# EAGLE design main (EAGLE 9.5.0)
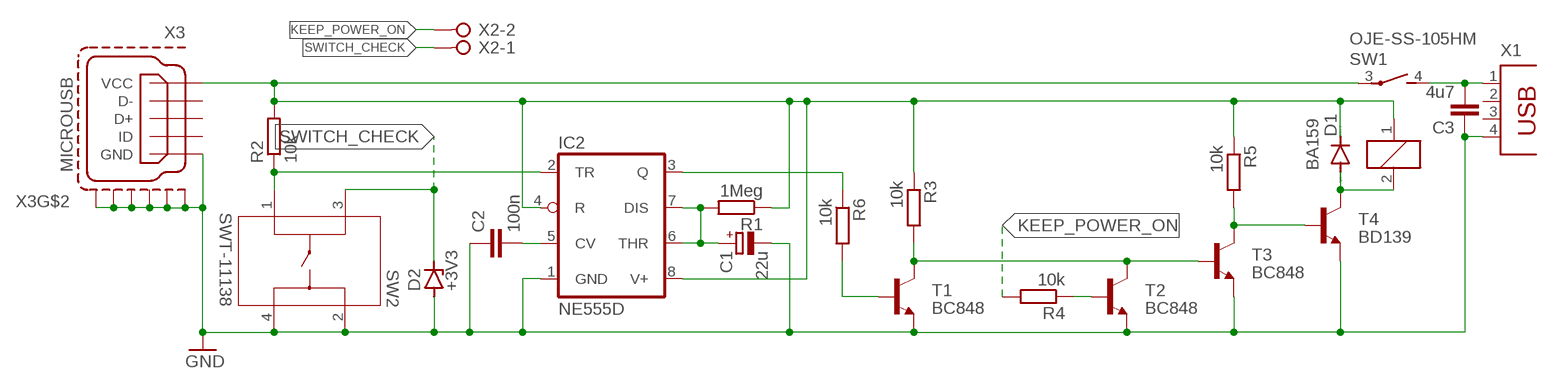
[diagram p0: schematic, sheet 1]

## Parts
C1  22u  CPOL-EUSMCB  [SMC_B]
C2  100n  C-EUC0805  [C0805]
C3  4u7  C-EU050-075X075  [C050-075X075]
D1  BA159  1N4004  [DO41-10]
D2  +3V3  ZENER-DIODESOD80C  [SOD80C]
IC2  NE555D  [SO08]
R1  1Meg  R-EU_R1206  [R1206]
R2  10k  R-EU_R1206  [R1206]
R3  10k  R-EU_R1206  [R1206]
R4  10k  R-EU_R1206  [R1206]
R5  10k  R-EU_R1206  [R1206]
R6  10k  R-EU_R1206  [R1206]
SW1  OJE-SS-105HM  [OJE-SS-105HM]
SW2  SWT-11138  [SWT-11138]
T1  BC848  [SOT23]
T2  BC848  [SOT23]
T3  BC848  [SOT23]
T4  BD139  [TO126]
X1  PN87520  [PN87520]
X2  W237-02P  [W237-132]
X3  MICROUSB  [MICROUSB]

## Nets
+5V [power]: D1.C IC2.4(R) IC2.8(V+) R1.1 R2.2 R3.1 R5.1 SW1.1 SW1.3(S:P) X3.1(VCC)
GND: C1.- C2.1 C3.1 D2.A IC2.1(GND) SW2.2 SW2.4 T1.2(E) T2.2(E) T3.2(E) T4.1(E) X1.4 X3.5(GND) X3.P$1(S1) X3.P$2(S2) X3.P$3(S3) X3.P$4(S4) X3.P$5(S5) X3.P$6(S6)
KEEP_POWER_ON: R4.2 X2.2
N$1: C1.+ IC2.6(THR) IC2.7(DIS) R1.2
N$2: R6.2 T1.1(B)
N$3: C2.2 IC2.5(CV)
N$4: IC2.2(TR) R2.1 SW2.1
N$5: IC2.3(Q) R6.1
N$12: R5.2 T3.3(C) T4.3(B)
N$15 [power]: C3.2 SW1.4(S:S) X1.1
N$19: R4.1 T2.1(B)
N$20: R3.2 T1.3(C) T2.3(C) T3.1(B)
N$21 [power]: D1.A SW1.2 T4.2(C)
SWITCH_CHECK: D2.C SW2.3 X2.1
Unconnected: X1.2 X1.3 X3.2(D-) X3.3(D+) X3.4(ID)

## Library data of the parts
C1 = rcl:CPOL-EU: POLARIZED CAPACITOR, European symbol; SPICEPREFIX: C
C2 C3 = rcl:C-EU: CAPACITOR, European symbol; SPICEPREFIX: C
D1 = diode:1N4004: DIODE general purpose rectifier, 1 A
D2 = diode:ZENER-DIODE: Z-Diode
IC2 = linear:*555: TIMER
R1-R6 = rcl:R-EU_: RESISTOR, European symbol; SPICEPREFIX: R
SW1 = Marcin-relay:OJE-SS-105HM: Miniature PCB Relay OJ/OJE
SW2 = Marcin-con:SWT-11138
T1-T3 = transistor:BC848: NPN TRANSISTOR
T4 = transistor:BD139: NPN TRANSISTOR
X1 = con-berg:PN87520: BERG USB connector; OC_FARNELL: unknown; OC_NEWARK: unknown
X2 = con-wago-508:W237-02P: WAGO SREW CLAMP; OC_FARNELL: unknown; OC_NEWARK: unknown
X3 = Marcin-con:MICROUSB: AMPHENOL 10118192-0001LF Micro USB type B Do zamówienia z TME <https://www.tme.eu/pl/details/10118192-0001lf_c/zlacza-usb-i-ieee1394/amphenol/10118192-0001lf/>

## Net classes
1 power: clearance 1.27 mm

## Board
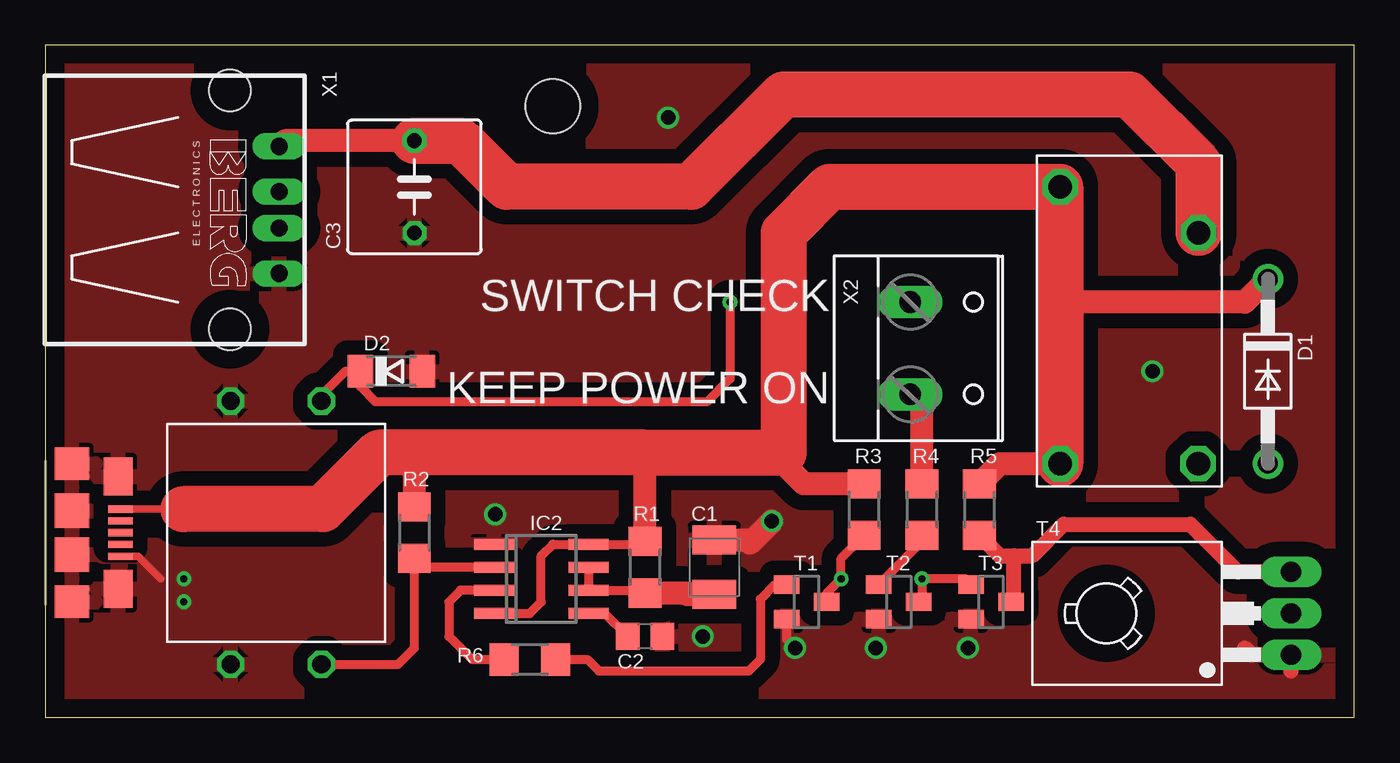
[diagram p1: board, top side]
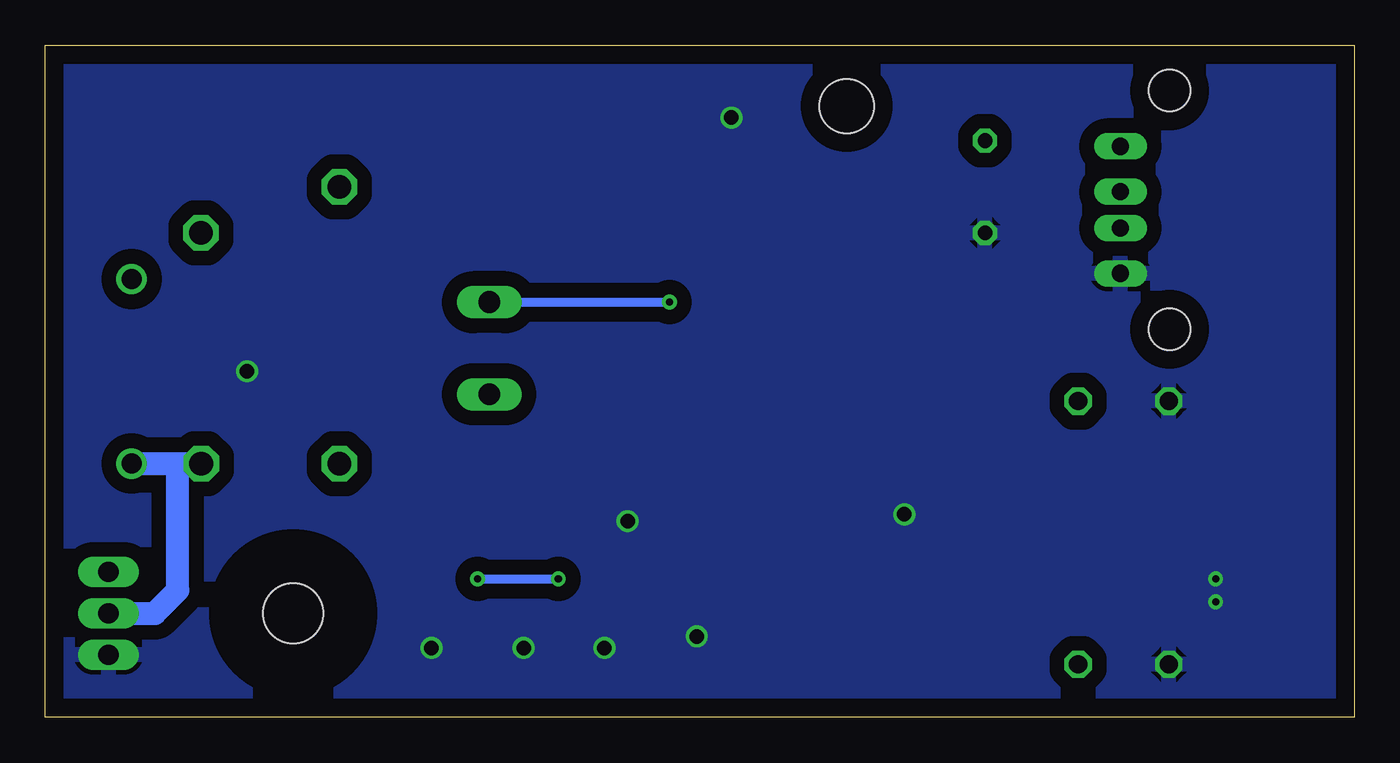
[diagram p2: board, bottom side, seen from below]

Size 72.06 x 37 mm. Coordinates in mm from the lower left corner, seen from the top.
Outline: 0,0 72.06,0 72.06,37 0,37 0,0
Copper layers (1*16): Top 0.035mm / dielectric 1.5mm / Bottom 0.035mm
Design rules "default *": minimum track width 6mil, minimum drill 0.35mm, track to track 6mil, track to pad 6mil, pad to pad 6mil, via to via 6mil, smd to smd 6mil, copper to edge 40mil, drill to drill 6mil, minimum pad ring 10mil, minimum via ring 8mil, stop-mask expansion 4mil, vias tented up to drill 0.4mm, thermal gap 10mil
Holes 3 mm at 27.94,33.65

### Footprints (pad centres in the part's own frame; a part is rotated, then mirrored left to right if it is on the bottom)
SMC_B = smd 1.6 x 2.4: + -1.5,0; - 1.5,0
C0805 = smd 1.3 x 1.5: 1 -0.95,0; 2 0.95,0
C050-075X075 = drill 0.813 octagon: 1 -2.54,0; 2 2.54,0
DO41-10 = drill 1.118: A 5.08,0; C -5.08,0
SOD80C = smd 1.4 x 1.8: A 1.7,0; C -1.7,0
SO08 = smd 0.6 x 2.2: 1 -1.905,-2.6; 2 -0.635,-2.6; 3 0.635,-2.6; 4 1.905,-2.6; 5 1.905,2.6; 6 0.635,2.6; 7 -0.635,2.6; 8 -1.905,2.6
R1206 = smd 1.6 x 1.803: 1 -1.422,0; 2 1.422,0
OJE-SS-105HM = drill 1.3 octagon: 1 0,0; 2 0,-7.6; 3 15.24,0; 4 12.7,-7.62
SWT-11138 = drill 1 octagon: 1 -2.5,7.25; 2 2.5,7.25; 3 -2.5,-7.25; 4 2.5,-7.25
SOT23 = smd 1 x 1.4: 1 -0.95,-1.1; 2 0.95,-1.1; 3 0,1.1
TO126 = drill 1.118 long: 1 -2.286,-5.08; 2 0,-5.08; 3 2.286,-5.08 | hole 3.302: 0,5.08
PN87520 = drill 0.95 long: 1 -3.5,2.71; 2 -1,2.71; 3 1,2.71; 4 3.5,2.71 | hole 2.3: -6.57,0; 6.57,0
W237-132 = drill 1.194 long: 1 -2.54,-0.635; 2 2.54,-0.635
MICROUSB = smd 0.4 x 1.35: 1 -1.3,4.125; 2 -0.65,4.125; 3 0,4.125; 4 0.65,4.125; 5 1.3,4.125 | smd 2.1 x 1.6: P$1 -3.1,4; P$2 3.1,4 | smd 1.8 x 1.9: P$3 3.8,1.45; P$4 -3.8,1.45 | smd 1.9 x 1.9: P$5 1.2,1.45; P$6 -1.2,1.45

### Placement (x,y rotation side)
C1  36.83,8.26 90 top
C2  33.02,4.45 180 top
C3  20.32,29.21 90 top
D1  67.31,19.05 270 top
D2  19.05,19.05 0 top
IC2  27.3,7.62 270 top
R1  33.02,8.26 270 top
R2  20.32,10.16 90 top
R3  45.08,11.43 270 top
R4  48.26,11.43 90 top
R5  51.43,11.43 270 top
R6  26.67,3.18 0 top
SW1  55.88,13.97 90 top
SW2  12.7,10.16 180 top
T1  41.91,6.35 270 top
T2  46.99,6.35 270 top
T3  52.07,6.35 270 top
T4  63.5,5.71 90 top
X1  10.16,27.94 270 top
X2  48.26,20.32 270 top
X3  0,10.16 270 top

### Tracks (layer width: path | path; a pad name or v marks a point on that pad's centre or on a via)
+5V
  Top 0.406: X3.1 7.59,11.46
  Top 0.508: R1.1 32.87,9.53 IC2.8 27.94,9.53 27.3,8.89 27.3,6.35 26.67,5.71 IC2.4
  Top 1.27: R5.1 52.55,13.97 SW1.1 | D1.C 66.04,22.86 55.88,22.86 | R3.1 41.76,12.85 40.64,13.97 40.64,14.57 | R1.1 33.02,14.57 | R2.2 20.32,14.57
  Top 2.54: SW1.1 55.88,22.86 SW1.3 43.18,29.21 40.64,26.67 40.64,14.57 33.02,14.57 20.32,14.57 18.38,14.57 15.27,11.46 7.59,11.46
GND  (via drill 0.4, 0.8)
  Top 0.406: X3.5 5.11,8.86 6.35,7.62
  Top 0.508: T1.2 40.81,4.28 v41.27,3.81 | IC2.1 24.77,9.59
  Top 0.813: 68.58,2.54 T4.1 66.42,3.43 66.04,3.81
  Top 1.27: v40,10.79 38.79,9.58 38.82,9.76 C1.-
  other vias: 34.29,33.02 60.96,19.05 24.77,11.18 45.72,3.81 50.8,3.81 36.2,4.45 7.62,7.62 7.62,6.35
  pour Bottom (isolate 0.813): 1.27,36.83 71.12,36.83 71.12,1.27 1.27,1.27
  pour Top (isolate 0.813): 1.27,36.83 1.27,1.27 71.12,1.27 71.12,36.83
KEEP_POWER_ON
  Top 1.27: R4.2 48.26,17.14 X2.2
N$1
  Top 0.508: R1.2 32.87,6.99 IC2.6 IC2.7
  Top 1.27: R1.2 35.41,6.83 35.33,6.76 C1.+
N$2
  Top 0.508: R6.2 29.84,3.18 30.48,2.54 38.73,2.54 39.37,3.18 39.37,6.49 40.17,7.3 T1.1
N$3
  Top 0.508: IC2.5 30.8,5.71 C2.2
N$4
  Top 0.508: SW2.1 19.42,2.91 20.32,3.81 R2.1 20.8,8.26 IC2.2
N$5
  Top 0.508: IC2.3 22.86,6.99 22.23,6.35 22.23,4.45 23.5,3.18 R6.1
N$12
  Top 0.813: T4.3 65.66,8 63.04,10.62 56.06,10.62 54.33,8.89 53.34,8.89 | R5.2 52.55,8.89 53.34,8.89 | T3.3 53.34,6.52 53.34,8.89
N$15
  Top 1.27: X1.1 13.18,31.75 C3.2
  Top 2.54: SW1.4 63.5,30.48 59.69,34.29 40.64,34.29 35.56,29.21 25.4,29.21 22.86,31.75 C3.2
N$19
  Top 0.508: R4.1 48.26,9.67 T2.1
N$20  (via drill 0.4)
  Top 0.508: T3.1 50.65,7.62 v48.26,7.62 48.26,6.52 T2.3 | R3.2 43.81,8.74 v43.81,7.62 43.01,6.82 T1.3
  Bottom 0.508: v48.26,7.62 v43.81,7.62
N$21
  Bottom 1.27: T4.2 66.04,5.71 64.77,6.99 64.77,13.97 | 64.77,13.97 SW1.2 | D1.A 64.77,13.97
SWITCH_CHECK  (via drill 0.4)
  Top 0.508: v37.7,22.86 37.7,18.65 36.42,17.37 23.35,17.37 18.19,17.37 17.35,18.21 D2.C 16.51,19.05 15.2,17.74 SW2.3
  Bottom 0.508: X2.1 v37.7,22.86

### Text on the board
tNames: SWITCH CHECK | KEEP POWER ON